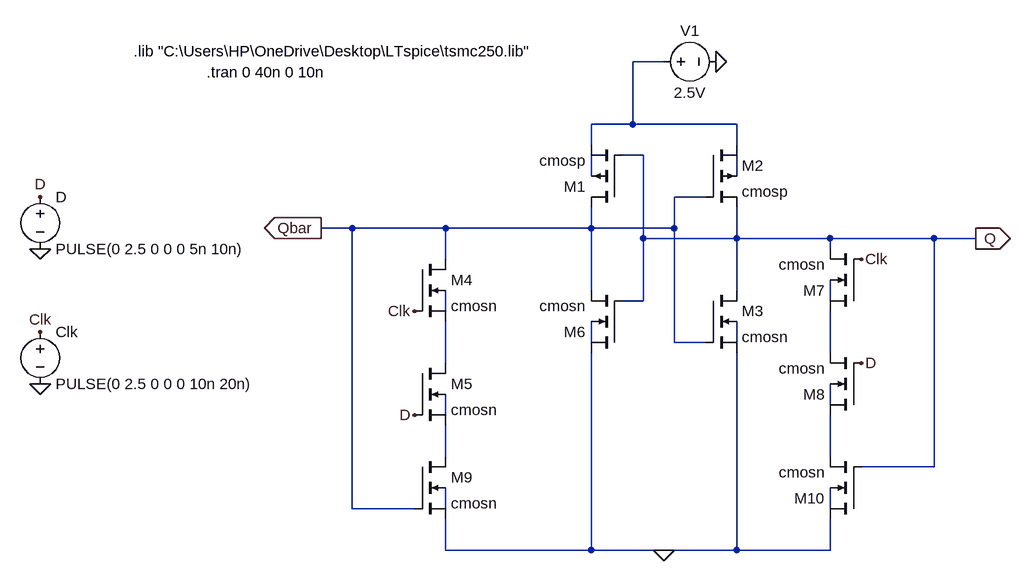
[diagram p0: schematic T_Latch.asc]
T_Latch.asc, the LTspice schematic file:
Version 4
SHEET 1 880 804
WIRE 272 -32 224 -32
WIRE 224 64 224 -32
WIRE 224 64 160 64
WIRE 384 64 224 64
WIRE 160 96 160 64
WIRE 384 96 384 64
WIRE 240 112 208 112
WIRE 160 144 160 112
WIRE 384 144 384 112
WIRE 336 176 288 176
WIRE -208 224 -256 224
WIRE -64 224 -208 224
WIRE 160 224 160 192
WIRE 160 224 -64 224
WIRE 288 224 288 176
WIRE 288 224 160 224
WIRE 240 240 240 112
WIRE 384 240 384 192
WIRE 384 240 240 240
WIRE 528 240 384 240
WIRE 688 240 528 240
WIRE 752 240 688 240
WIRE 528 256 528 240
WIRE -64 272 -64 224
WIRE 160 320 160 224
WIRE 384 320 384 240
WIRE 240 336 240 240
WIRE 240 336 208 336
WIRE 528 336 528 304
WIRE -64 352 -64 320
WIRE 160 400 160 368
WIRE 288 400 288 224
WIRE 336 400 288 400
WIRE 384 400 384 368
WIRE 528 416 528 352
WIRE -64 432 -64 368
WIRE 528 496 528 464
WIRE -64 512 -64 480
WIRE -64 576 -64 528
WIRE 528 576 528 512
WIRE 688 592 688 240
WIRE 688 592 576 592
WIRE -208 656 -208 224
WIRE -112 656 -208 656
WIRE -64 656 -64 624
WIRE 528 656 528 624
WIRE -64 720 -64 672
WIRE 160 720 160 416
WIRE 160 720 -64 720
WIRE 272 720 160 720
WIRE 384 720 384 416
WIRE 384 720 272 720
WIRE 528 720 528 672
WIRE 528 720 384 720
FLAG -688 256 0
FLAG -688 464 0
FLAG -688 384 Clk
FLAG -112 352 Clk
FLAG 576 272 Clk
FLAG -688 176 D
FLAG -112 512 D
FLAG 576 432 D
FLAG 752 240 Q
IOPIN 752 240 Out
FLAG -256 224 Qbar
IOPIN -256 224 Out
FLAG 352 -32 0
FLAG 272 720 0
SYMBOL pmos4 208 192 R180
SYMATTR InstName M1
SYMATTR Value cmosp
SYMATTR Value2 l=240n w=360n
SYMBOL pmos4 336 96 R0
SYMATTR InstName M2
SYMATTR Value cmosp
SYMATTR Value2 l=240n w=360n
SYMBOL nmos4 336 320 R0
SYMATTR InstName M3
SYMATTR Value cmosn
SYMATTR Value2 l=240n w=360n
SYMBOL nmos4 -112 272 R0
SYMATTR InstName M4
SYMATTR Value cmosn
SYMATTR Value2 l=240n w=360n
SYMBOL nmos4 -112 432 R0
SYMATTR InstName M5
SYMATTR Value cmosn
SYMATTR Value2 l=240n w=360n
SYMBOL nmos4 208 416 R180
SYMATTR InstName M6
SYMATTR Value cmosn
SYMATTR Value2 l=240n w=360n
SYMBOL nmos4 576 352 R180
SYMATTR InstName M7
SYMATTR Value cmosn
SYMATTR Value2 l=240n w=360n
SYMBOL nmos4 576 512 R180
SYMATTR InstName M8
SYMATTR Value cmosn
SYMATTR Value2 l=240n w=360n
SYMBOL voltage 256 -32 R270
WINDOW 0 32 56 VTop 2
WINDOW 3 -32 56 VBottom 2
SYMATTR InstName V1
SYMATTR Value 2.5V
SYMBOL voltage -688 160 R0
WINDOW 123 0 0 Left 0
WINDOW 39 0 0 Left 0
SYMATTR InstName D
SYMATTR Value PULSE(0 2.5 0 0 0 5n 10n)
SYMBOL voltage -688 368 R0
WINDOW 123 0 0 Left 0
WINDOW 39 0 0 Left 0
SYMATTR InstName Clk
SYMATTR Value PULSE(0 2.5 0 0 0 10n 20n)
SYMBOL nmos4 -112 576 R0
SYMATTR InstName M9
SYMATTR Value cmosn
SYMATTR Value2 l=240n w=360n
SYMBOL nmos4 576 672 R180
SYMATTR InstName M10
SYMATTR Value cmosn
SYMATTR Value2 l=240n w=360n
TEXT -544 -48 Left 2 !.lib "C:\\Users\\HP\\OneDrive\\Desktop\\LTspice\\tsmc250.lib"
TEXT -432 -16 Left 2 !.tran 0 40n 0 10n

The netlist it stands for:
* T_Latch.asc
M1 Qbar Q N001 N002 cmosp l=240n w=360n
M2 N001 Qbar Q N003 cmosp l=240n w=360n
M3 Q Qbar 0 N007 cmosn l=240n w=360n
M4 Qbar Clk N009 N005 cmosn l=240n w=360n
M5 N009 D N012 N011 cmosn l=240n w=360n
M6 0 Q Qbar N006 cmosn l=240n w=360n
M7 N008 Clk Q N004 cmosn l=240n w=360n
M8 N013 D N008 N010 cmosn l=240n w=360n
V1 N001 0 2.5V
V§D D 0 PULSE(0 2.5 0 0 0 5n 10n)
V§Clk Clk 0 PULSE(0 2.5 0 0 0 10n 20n)
M9 N012 Qbar 0 N014 cmosn l=240n w=360n
M10 0 Q N013 N015 cmosn l=240n w=360n
.model NMOS NMOS
.model PMOS PMOS
.lib standard.mos
.lib "C:\Users\HP\OneDrive\Desktop\LTspice\tsmc250.lib"
.tran 0 40n 0 10n
.backanno
.end